# Altium schematic sheet RA-08_IC.SchDoc
size A4
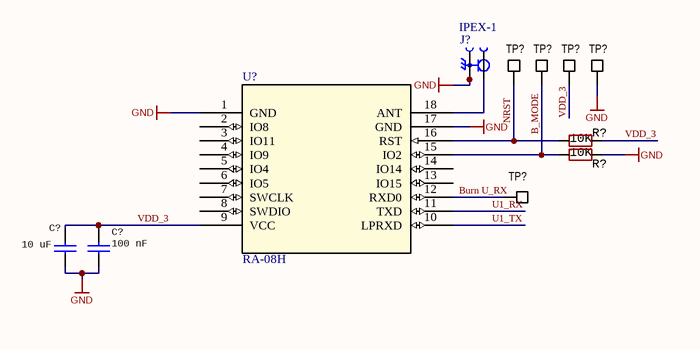
[diagram p0: RA-08_IC.SchDoc]

## Parts
(Parts that share a designator on the sheet are numbered #1, #2 ... from top to bottom, then left to right.)
C?#1  value 10 uF  [0603_CAPASITOR]  (hidden comment: Capacitor)
C?#2  value 100 nF  [0603_CAPASITOR]  (hidden comment: Capacitor)
J?  IPEX-1  [IPEX-1_connector]
R?#1  value 10K  [0603_RESISTOR]  (hidden comment: resistor)
R?#2  value 10K  [0603_RESISTOR]  (hidden comment: resistor)
TP?#1  NRST  [TEST_POINT_SMD_1mm]  (value not drawn)  (no BOM)
TP?#2  B_MODE  [TEST_POINT_SMD_1mm]  (value not drawn)  (no BOM)
TP?#3  VDD  [TEST_POINT_SMD_1mm]  (value not drawn)  (no BOM)
TP?#4  G  [TEST_POINT_SMD_1mm]  (value not drawn)  (no BOM)
TP?#5  Burn U_RX  [TEST_POINT_SMD_1mm]  (value not drawn)  (no BOM)
U?  RA-08H  [MOD18_RA-08H_AIT]

## Nets
GND: C?#1.1 C?#2.1 J?.2(GROUND) J?.3(GROUND) R?#2.1 TP?#4.1 U?.1(GND) U?.17(GND)
B_MODE: R?#2.2 TP?#2.1 U?.15(IO2)
Burn U_RX: TP?#5.1 U?.12(RXD0)
NRST: R?#1.2 TP?#1.1 U?.16(RST)
U1_RX: U?.11(TXD)
U1_TX: U?.10(LPRXD)
VDD_3: C?#1.2 C?#2.2 R?#1.1 TP?#3.1 U?.9(VCC)
NetJ?_1: J?.1(SIGNAL) U?.18(ANT)

Not connected (* = marked no-connect by the designer): U? 2(IO8) 3(IO11) 4(IO9) 5(IO4) 6(IO5) 7(SWCLK) 8(SWDIO) 13(IO15) 14(IO14)

## Library data of the parts
C?#1 = capacitor_smd: Voltage: 10V; Tolerance: ±20%; Dielectric: X5R/X7R; Package: 0603
C?#2 = capacitor_smd: Voltage: 6V; Tolerance: ±20%; Dielectric: X5R/X7R; Package: 0603
J? = IPEX-1: 1 POS Vertical SMD Small form factor with big performance through 6 GHz connector,MHF, RF, micro-coaxial MHF I Receptacle; MF: I-PEX; MP: 20279-001E-03; SnapEDA_Link: https://www.snapeda.com/parts/20279-001E-03/I-PEX/view-part/?ref=snap; Package: IPEX-1; Value: *; Check_prices: https://www.snapeda.com/parts/20279-001E-03/I-PEX/view-part/?ref=eda
R?#1 R?#2 = resistor: Tolerance: ±5%; Power: 0.125W; Package: 0603
TP?#1-TP?#5 = test_point_single
U? = RA-08H: Description; Manufacturer_Name: Ai-Thinker; Type: RF; Copyright: Copyright (C) 2025 Ultra Librarian. All rights reserved.; Manufacturer_Part_Number: RA-08H; RefDes: RefDes